# Altium schematic sheet Indicators.SchDoc
size A; SheetNumber: 6; SheetTotal: 7
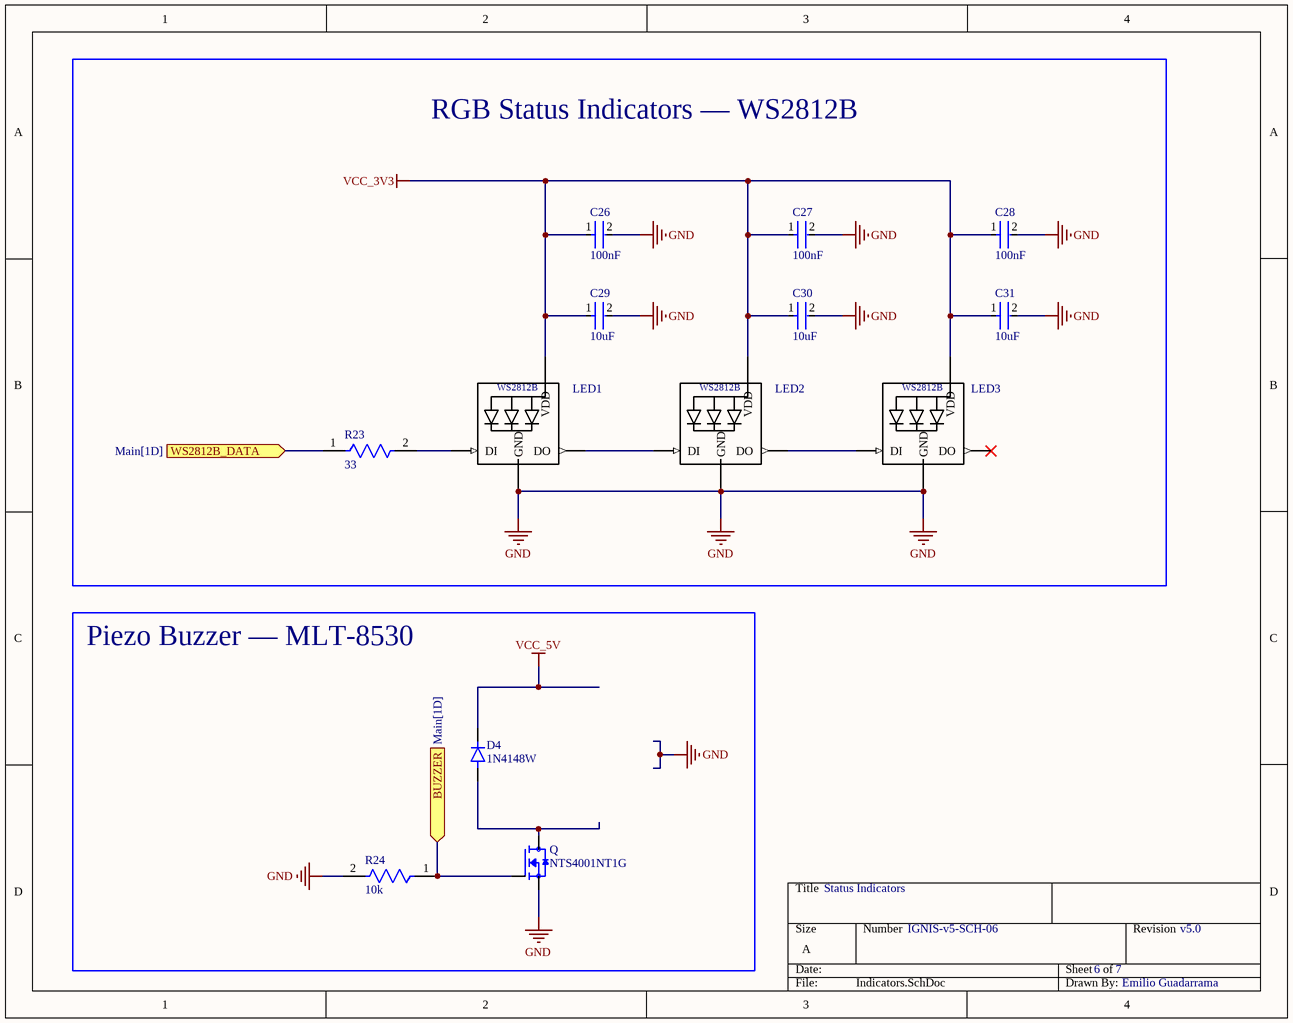
[diagram p0: Indicators.SchDoc]

## Parts
C26  100nF  [FP-C0805C-DN-MFG]
C27  100nF  [FP-C0805C-DN-MFG]
C28  100nF  [FP-C0805C-DN-MFG]
C29  10uF  [FP-C0805C-DN-MFG]
C30  10uF  [FP-C0805C-DN-MFG]
C31  10uF  [FP-C0805C-DN-MFG]
D4  1N4148W  [SODFL3816X120N]
LED1  WS2812B  [*LED3535]  (value not drawn)
LED2  WS2812B  [*LED3535]  (value not drawn)
LED3  WS2812B  [*LED3535]  (value not drawn)
Q  NTS4001NT1G  [SOT65P220X100-3N]
R23  33  [FP-MCT0603-IPC_A]
R24  10k  [FP-MCT0603-IPC_A]

## Blocks framed on the sheet
RGB Status Indicators — WS2812B: C26-C31 LED1-LED3 R23
Piezo Buzzer — MLT-8530: D4 Q R24

## Ports
BUZZER (in, see Main[1D]), WS2812B_DATA (in, see Main[1D])

## Nets
GND: C26.2 C27.2 C28.2 C29.2 C30.2 C31.2 LED1.3(GND) LED2.3(GND) LED3.3(GND) Q.2(S) R24.2
VCC_3V3: C26.1 C27.1 C28.1 C29.1 C30.1 C31.1 LED1.1(VDD) LED2.1(VDD) LED3.1(VDD)
VCC_5V: D4.C(K)
BUZZER: Q.1(G) R24.1 ; port BUZZER
WS2812B_DATA: R23.1 ; port WS2812B_DATA
NetD4_A: D4.A Q.3(D)
NetLED1_2: LED1.2(DO) LED2.4(DI)
NetLED1_4: LED1.4(DI) R23.2
NetLED2_2: LED2.2(DO) LED3.4(DI)

Not connected (* = marked no-connect by the designer): LED3 2(DO)*

## Notes on the sheet
- Status Indicators
- IGNIS-v5-SCH-06
- 6
- 7
- v5.0
- Emilio Guadarrama

## Library data of the parts
C26-C31 = CMP-2007-00279-2: CAP CER 0.1UF 50V X7R 0805; Manufacturer Part Number: C0805C104K5RACTU; Manufacturer: KEMET; Tolerance: 0.1; Temperature Coefficient: 30ppm/°C; Material: Ceramic; Device Class L2: Capacitors; Temperature Range Low: -55°C; Voltage Rating: 50 V; Digikey Description: CAP CER 0.1UF 50V X7R 0805; Category: Cap; ComponentLink2Description: Datasheet; Octopart: https://octopart.com/c0805c104k5ractu-kemet-143926; RoHS: TRUE; ComponentLink2URL: https://content.kemet.com/datasheets/KEM_C1003_C0G_SMD.pdf; Temperature Characteristic: X7R; Temperature: -55°C to +125°C; Height: 0.88mm; Temperature Range High: +125°C; Device Class L1: Passive Components; Automotive: No; Lead Free: Yes; Ipc Land Pattern Name: CAPC200125X78; Device Class L3: Ceramic Capacitors; Mouser Description: Cap Ceramic 0.1uF 50V X7R 10% SMD 2.0 x 1.2 mm 125 C Paper T/R; Package: C0805C-DN
  C26-C28: Value: 100 nF; Capacitance: 100 nF
  C29-C31: Value: 10 uF; Capacitance: 10 uF
D4 = 1N4148W: Small Signal Diode, SOD-123F, 100V, 0.15A, 150Â°C; MF: Diotec Semiconductor; SnapEDA_Link: https://www.snapeda.com/parts/1N4148W/Diotec/view-part/?ref=snap; Package: SOD-123F Diotec; Value: *; MP: 1N4148W; Check_prices: https://www.snapeda.com/parts/1N4148W/Diotec/view-part/?ref=eda
LED1-LED3 = WS2812B: Intelligent control LED integrated light source; MF: Worldsemi; SnapEDA_Link: https://www.snapeda.com/parts/WS2812B/Worldsemi/view-part/?ref=snap; Package: None; MP: WS2812B; Check_prices: https://www.snapeda.com/parts/WS2812B/Worldsemi/view-part/?ref=eda; Value: *
Q = NTS4001NT1G: N-Channel 30V 270mA _Ta_ 330mW _Ta_ Surface Mount SC-70-3 _SOT323_; MF: ON Semiconductor; Package: SC-70 ON Semiconductor; MP: NTS4001NT1G; SnapEDA_Link: https://www.snapeda.com/parts/NTS4001NT1G/ON%20Semiconductor/view-part/274588/?ref=snap; Price: None; Value: *; Availability: Unavailable
R23 = CMP-02407-011165-1: RES SMD 100 OHM 1% 1/8W 0603; Temperature Coefficient: 25ppm/°C; Resistance: 33R; Power Rating: 125mW; Tolerance: 0.1%; Voltage Rating: 75V; Length: 1.55mm; Case Code (Imperial): 0603; Case/Package: 0603; Construction: Rectangular; Package Quantity: 1000; Number of Terminations: 2; Termination: SMD/SMT; Resistor Type: Thin Film; Features: Automotive AEC-Q200; Series: MCT 0603 - Precision; Max Operating Temperature: 155°C; Depth: 0.85mm; Max Power Dissipation: 125mW; Min Operating Temperature: -55°C; Width: 0.033inch; Case Code (Metric): 1608; Packaging: Tape and Reel; Weight: 6.7E-05oz; Military Standard: Not; Height: 0.022inch
R24 = CMP-02407-011165-1: RES SMD 100 OHM 1% 1/8W 0603; Temperature Coefficient: 25ppm/°C; Resistance: 10kR; Power Rating: 125mW; Tolerance: 0.1%; Voltage Rating: 75V; Length: 1.55mm; Case Code (Imperial): 0603; Case/Package: 0603; Construction: Rectangular; Package Quantity: 1000; Number of Terminations: 2; Termination: SMD/SMT; Resistor Type: Thin Film; Features: Automotive AEC-Q200; Series: MCT 0603 - Precision; Max Operating Temperature: 155°C; Depth: 0.85mm; Max Power Dissipation: 125mW; Min Operating Temperature: -55°C; Width: 0.033inch; Case Code (Metric): 1608; Packaging: Tape and Reel; Weight: 6.7E-05oz; Military Standard: Not; Height: 0.022inch